# Altium schematic sheet SD_Card.SchDoc
size A4; SheetNumber: 7; SheetTotal: 6
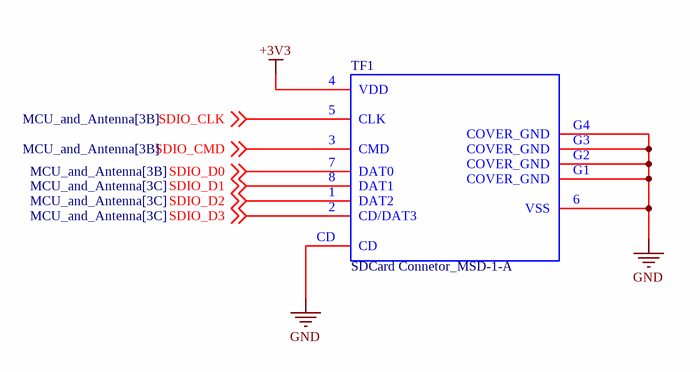
[diagram p0: SD_Card.SchDoc]

## Parts
TF1  SDCard Connetor_MSD-1-A  [CUI_MSD-1-A]

## Nets
+3V3: TF1.4(VDD)
GND: TF1.6(VSS) TF1.CD TF1.G1(COVER_GND) TF1.G2(COVER_GND) TF1.G3(COVER_GND) TF1.G4(COVER_GND)
SDIO_CLK: TF1.5(CLK) ; off-sheet SDIO_CLK
SDIO_CMD: TF1.3(CMD) ; off-sheet SDIO_CMD
SDIO_D0: TF1.7(DAT0) ; off-sheet SDIO_D0
SDIO_D1: TF1.8(DAT1) ; off-sheet SDIO_D1
SDIO_D2: TF1.1(DAT2) ; off-sheet SDIO_D2
SDIO_D3: TF1.2(CD/DAT3) ; off-sheet SDIO_D3

## Library data of the parts
TF1 = MSD-1-A: Card Connector, Micro Sd, Push In Auto Eject Out Rohs Compliant: Yes |Same Sky MSD-1-A; Number of Contacts: 9; Supplier: DigiKey; Supplier Part Number: 2223-MSD-1-ADKR-ND; Manufacturer: Same Sky; Manufacturer Part Number: MSD-1-A; RoHS: Compliant; Category: Card Edge Connectors; Stock: 22918; Pricing: 1=0,38, 10=0,337, 25=0,3212, 50=0,3096, 100=0,2985, 250=0,28452, 500=0,27438 (USD); Lifecycle Status: Production; Pins: 9; ComponentLink1URL: https://datasheet.octopart.com:443/MSD-1-A-Same-Sky-datasheet-188826037.pdf?src-supplier=Future+Electronics; ComponentLink1Description: https://datasheet.octopart.com:443/MSD-1-A-Same-Sky-datasheet-188826037.pdf?src-supplier=Future+Electronics; ComponentLink2URL: https://datasheet.octopart.com:443/MSD-1-A-Same-Sky-datasheet-181916823.pdf?src-supplier=Same+Sky; ComponentLink2Description: https://datasheet.octopart.com:443/MSD-1-A-Same-Sky-datasheet-181916823.pdf?src-supplier=Same+Sky; ComponentLink3URL: https://datasheet.octopart.com:443/MSD-1-A-Same-Sky-datasheet-187906752.pdf?src-supplier=Master+Electronics; ComponentLink3Description: https://datasheet.octopart.com:443/MSD-1-A-Same-Sky-datasheet-187906752.pdf?src-supplier=Master+Electronics; ComponentLink4URL: https://datasheet.octopart.com:443/MSD-1-A-Same-Sky-datasheet-189105030.pdf?src-supplier=Master+Electronics; ComponentLink4Description: https://datasheet.octopart.com:443/MSD-1-A-Same-Sky-datasheet-189105030.pdf?src-supplier=Master+Electronics; ComponentLink5URL: https://datasheet.octopart.com:443/MSD-1-A-Same-Sky-datasheet-192927133.pdf?src-supplier=Farnell; ComponentLink5Description: https://datasheet.octopart.com:443/MSD-1-A-Same-Sky-datasheet-192927133.pdf?src-supplier=Farnell; ComponentLink6URL: https://octopart.com:443/opatz8j6/c1?t=vp1p1RiQ7_bbECyTA0y4sfTKdNK0uxHJB4IJybVem8wfn_d81AkevM-28rbvRvGobWwflIHzG1kFMVOfj4kHg7XvkbfSCEJ7QJUOw8RagXeSWULw5ToeuFDdJR7Bt4vxDtry0ssBHcqByyX6VfftwN1L4faraza0AI-7RGbWMwA6F9LSqLt9_EMr0BxlEhXuXrshFT8wtW-WV5rQURwZJFG16ertrOprtftK68kM6a6LFeToBh8QSflZEyNvhx9JPCtmtoosfXqgwYVYCg7S3alAAaytfdeoLFI4QoT-ekVsdXkV83oacCLK0qWz3So_Qz_4GnTlkdSuyzdB_i-sEeuXWT3vb9ZdCw&src-supplier=Compliance+Statements; ComponentLink6Description: https://octopart.com:443/opatz8j6/c1?t=vp1p1RiQ7_bbECyTA0y4sfTKdNK0uxHJB4IJybVem8wfn_d81AkevM-28rbvRvGobWwflIHzG1kFMVOfj4kHg7XvkbfSCEJ7QJUOw8RagXeSWULw5ToeuFDdJR7Bt4vxDtry0ssBHcqByyX6VfftwN1L4faraza0AI-7RGbWMwA6F9LSqLt9_EMr0BxlEhXuXrshFT8wtW-WV5rQURwZJFG16ertrOprtftK68kM6a6LFeToBh8QSflZEyNvhx9JPCtmtoosfXqgwYVYCg7S3alAAaytfdeoLFI4QoT-ekVsdXkV83oacCLK0qWz3So_Qz_4GnTlkdSuyzdB_i-sEeuXWT3vb9ZdCw&src-supplier=Compliance+Statements; ComponentLink7URL: https://octopart.com:443/opatz8j6/c1?t=wAi6ISJASBnr8eO6lSjSIHP2me3m_9JM9t7W5VqSuSqxXYYJcLah3NUVD-7KOeeDFDGTRMzH8uuSVpkC-dK8fDh7z78_Zz7yIXmwbgIJI1qZCq7xwXiaEBLQXT6ZnDMy6rrDwlb80FwwLiQM50BkdkbR5EeE1LfLeWHnwravg99_jLWlkSIiScvx2zQpJINNM4l5hIZMqDUJfGPmTvGFOpba4p3TKJetJ1SK5RMzhW7EBLCMyaFc11RY6XyCtek_Rl1wWLfJ0x3653ljfiWvaBt52Rr3c_7yFcHOKK0ZDwbDeFPkBPIVfLA_uDjBt4Uz3XRATwQr3zhnt-anWoerKFWB3yJpHzj1KQ&src-supplier=Compliance+Statements; ComponentLink7Description: https://octopart.com:443/opatz8j6/c1?t=wAi6ISJASBnr8eO6lSjSIHP2me3m_9JM9t7W5VqSuSqxXYYJcLah3NUVD-7KOeeDFDGTRMzH8uuSVpkC-dK8fDh7z78_Zz7yIXmwbgIJI1qZCq7xwXiaEBLQXT6ZnDMy6rrDwlb80FwwLiQM50BkdkbR5EeE1LfLeWHnwravg99_jLWlkSIiScvx2zQpJINNM4l5hIZMqDUJfGPmTvGFOpba4p3TKJetJ1SK5RMzhW7EBLCMyaFc11RY6XyCtek_Rl1wWLfJ0x3653ljfiWvaBt52Rr3c_7yFcHOKK0ZDwbDeFPkBPIVfLA_uDjBt4Uz3XRATwQr3zhnt-anWoerKFWB3yJpHzj1KQ&src-supplier=Compliance+Statements; LCSC Part: C20619272